# Altium schematic sheet rgb.SchDoc: Dankboard - RGB
size A4; Author: Alexander Cafarella; CompanyName: Dank; DrawnBy: Alexander Cafarella; Engineer: Alexander Cafarella; Organization: Dank; SheetNumber: 3; SheetTotal: 3